# Altium project sig_gen_card.PrjPcb (part 2 of 4)

## Sheet Power.SchDoc
size B; Organization: Mechanart, LLC; Address1: 397 Laurie Meadows Drive; Address2: Apt. 437; Address3: San Mateo, CA 94403
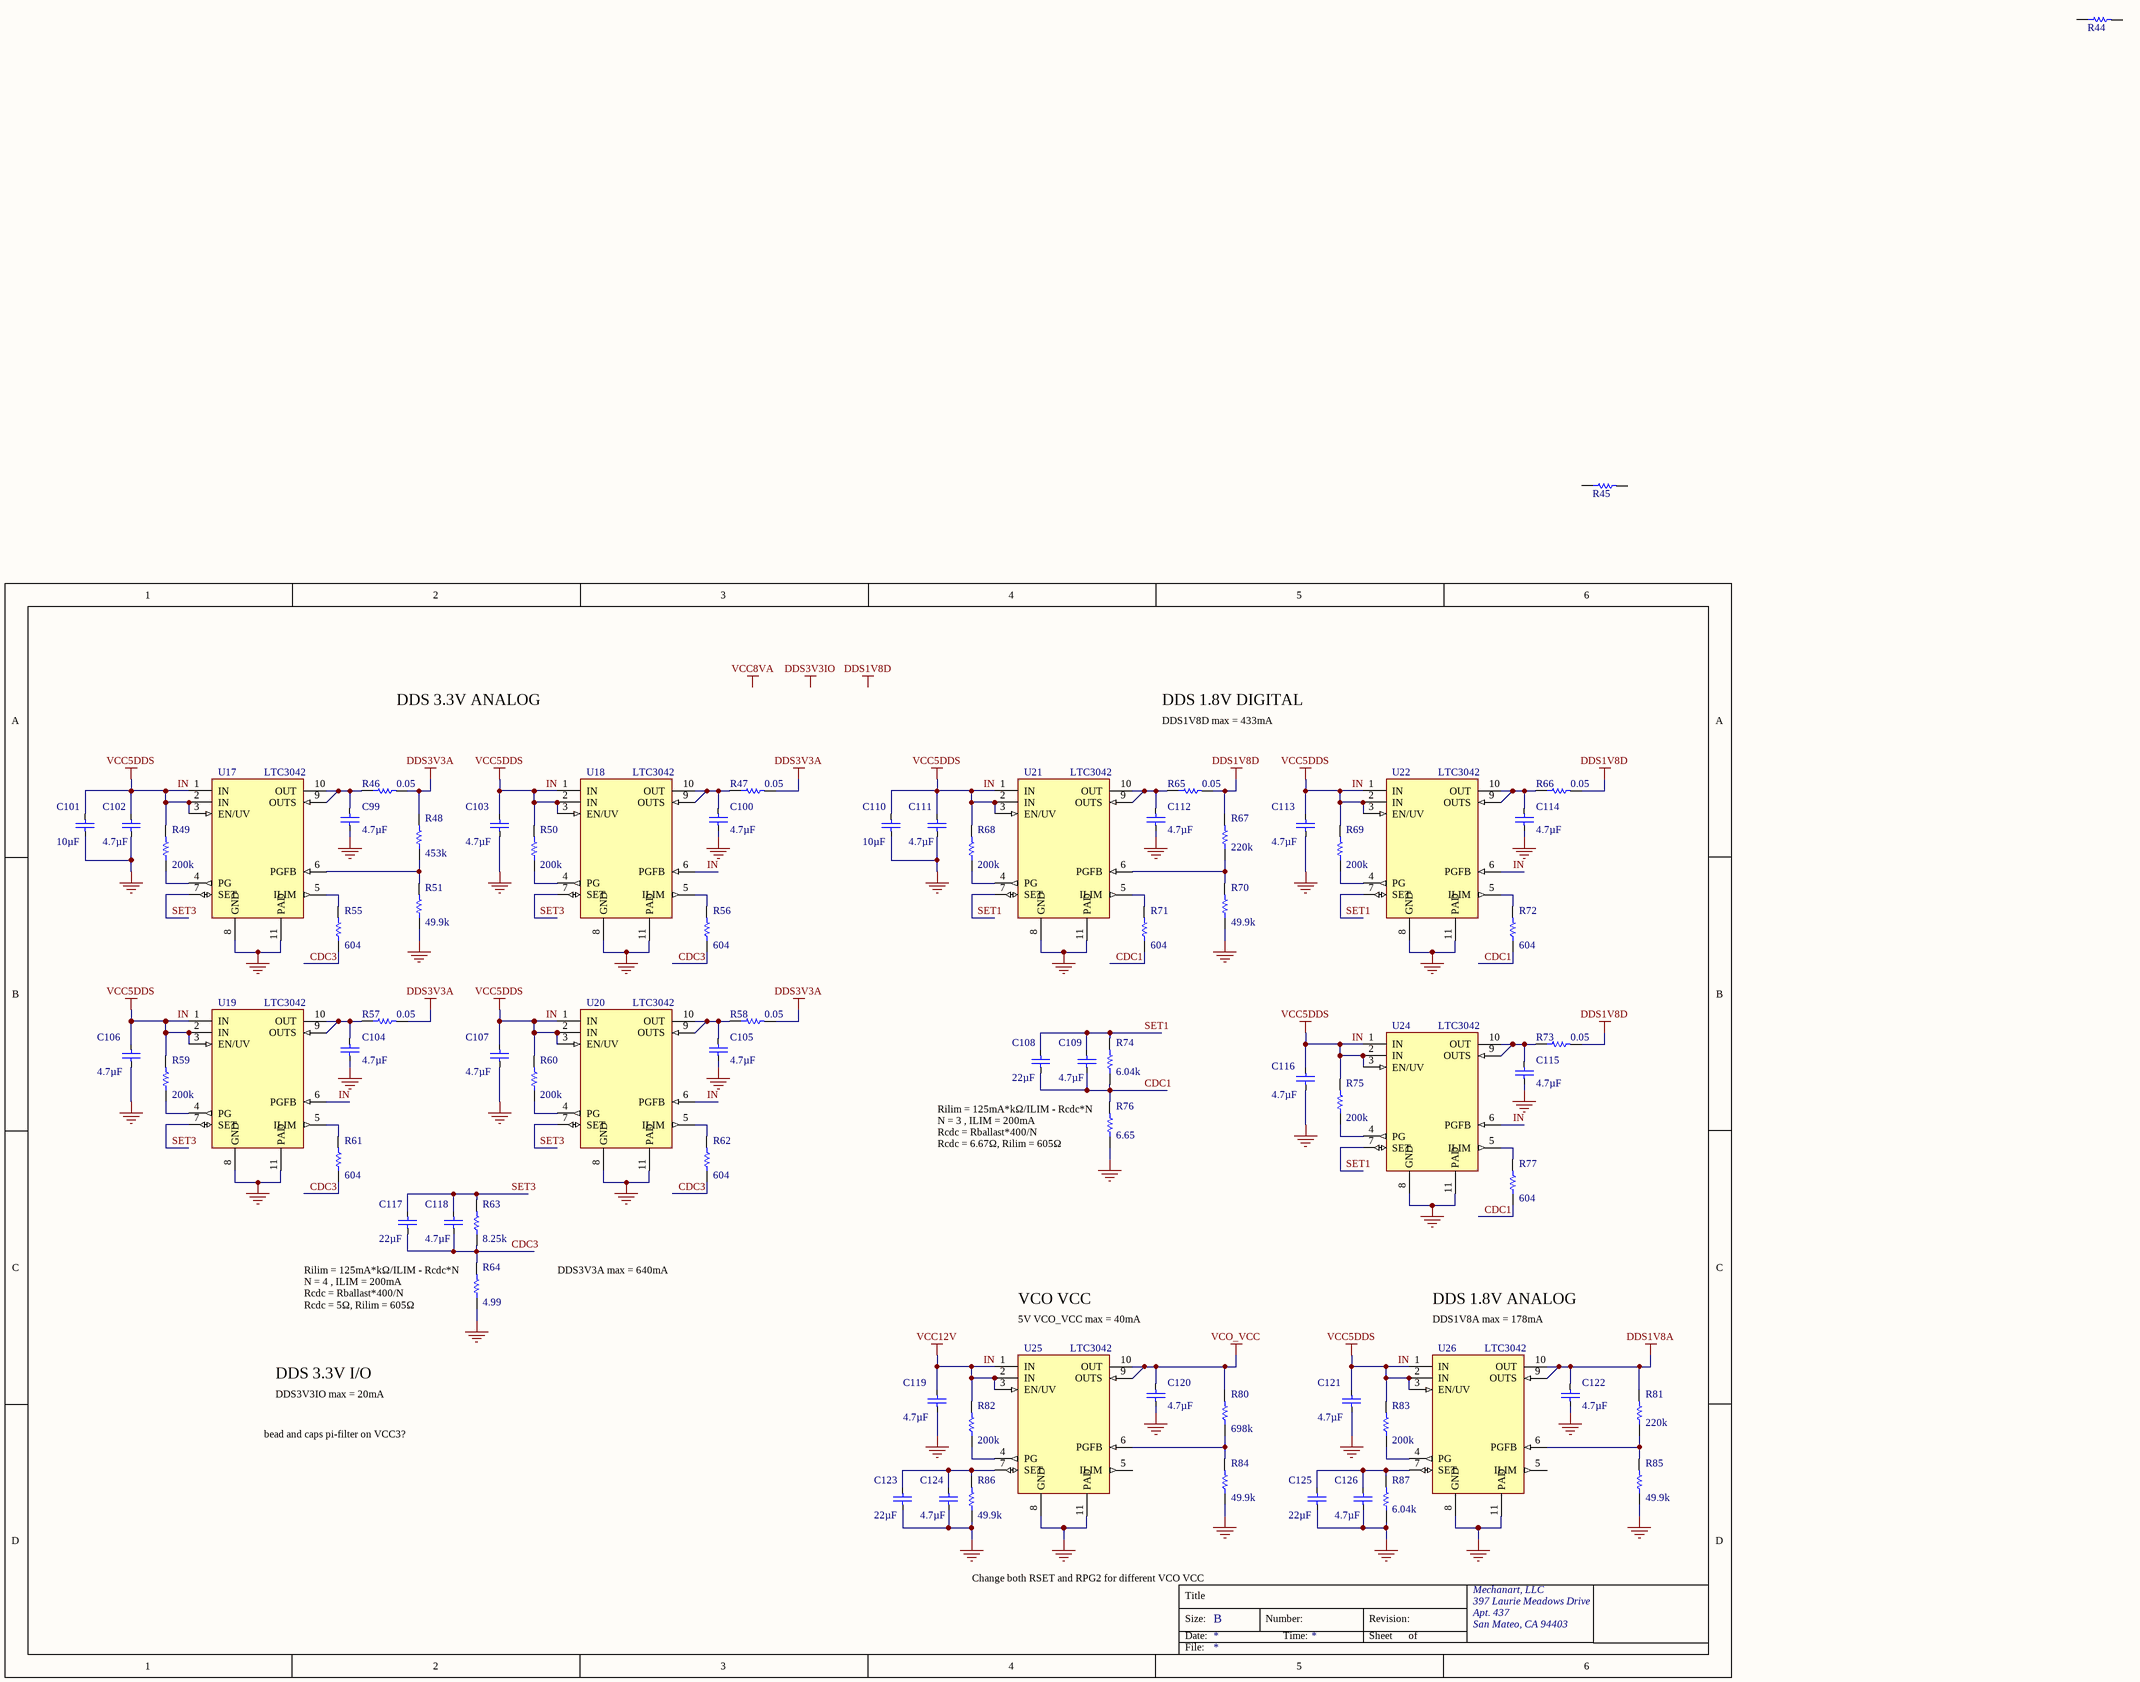
[diagram p3: Power.SchDoc]

### Parts
(Parts that share a designator on the sheet are numbered #1, #2 ... from top to bottom, then left to right.)
C99#1  4.7µF  [CAPC3216X160L55N]
C100#1  4.7µF  [CAPC3216X160L55N]
C101#1  10µF  [CAPC3216X160L55N]
C102#1  4.7µF  [CAPC3216X160L55N]
C103  4.7µF  [CAPC3216X160L55N]
C104  4.7µF  [CAPC3216X160L55N]
C105  4.7µF  [CAPC3216X160L55N]
C106  4.7µF  [CAPC3216X160L55N]
C107  4.7µF  [CAPC3216X160L55N]
C108  22µF  [CAPC2012X145L30N]
C109  4.7µF  [CAPC3216X160L55N]
C110  10µF  [CAPC3216X160L55N]
C111  4.7µF  [CAPC3216X160L55N]
C112  4.7µF  [CAPC3216X160L55N]
C113  4.7µF  [CAPC3216X160L55N]
C114  4.7µF  [CAPC3216X160L55N]
C115  4.7µF  [CAPC3216X160L55N]
C116  4.7µF  [CAPC3216X160L55N]
C117  22µF  [CAPC2012X145L30N]
C118  4.7µF  [CAPC3216X160L55N]
C119  4.7µF  [CAPC3216X160L55N]
C120  4.7µF  [CAPC3216X160L55N]
C121  4.7µF  [CAPC3216X160L55N]
C122  4.7µF  [CAPC3216X160L55N]
C123  22µF  [CAPC2012X145L30N]
C124  4.7µF  [CAPC3216X160L55N]
C125  22µF  [CAPC2012X145L30N]
C126  4.7µF  [CAPC3216X160L55N]
R44  0.05  [RESC_2012[0805]_N]  (value not drawn)
R45  8.25k  [RESC1608X45L30N]  (value not drawn)
R46  0.05  [RESC_2012[0805]_N]
R47  0.05  [RESC_2012[0805]_N]
R48  453k  [RESC1608X45L30N]
R49  200k  [RESC1608X45L30N]
R50  200k  [RESC1608X45L30N]
R51  49.9k  [RESC1608X45L30N]
R55  604  [RESC1608X45L30N]
R56  604  [RESC1608X45L30N]
R57  0.05  [RESC_2012[0805]_N]
R58  0.05  [RESC_2012[0805]_N]
R59  200k  [RESC1608X45L30N]
R60  200k  [RESC1608X45L30N]
R61  604  [RESC1608X45L30N]
R62  604  [RESC1608X45L30N]
R63  8.25k  [RESC1608X45L30N]
R64  4.99  [RESC1608X45L30N]
R65  0.05  [RESC_2012[0805]_N]
R66  0.05  [RESC_2012[0805]_N]
R67  220k  [RESC1608X45L30N]
R68  200k  [RESC1608X45L30N]
R69  200k  [RESC1608X45L30N]
R70  49.9k  [RESC1608X45L30N]
R71  604  [RESC1608X45L30N]
R72  604  [RESC1608X45L30N]
R73  0.05  [RESC_2012[0805]_N]
R74  6.04k  [RESC1608X45L30N]
R75  200k  [RESC1608X45L30N]
R76  6.65  [RESC1608X45L30N]
R77  604  [RESC1608X45L30N]
R80  698k  [RESC1608X45L30N]
R81  220k  [RESC1608X45L30N]
R82  200k  [RESC1608X45L30N]
R83  200k  [RESC1608X45L30N]
R84  49.9k  [RESC1608X45L30N]
R85  49.9k  [RESC1608X45L30N]
R86  49.9k  [RESC1608X45L30N]
R87  6.04k  [RESC1608X45L30N]
U17  LTC3042  [SON50P300X300X75-11T175X248L]
U18  LTC3042  [SON50P300X300X75-11T175X248L]
U19  LTC3042  [SON50P300X300X75-11T175X248L]
U20  LTC3042  [SON50P300X300X75-11T175X248L]
U21  LTC3042  [SON50P300X300X75-11T175X248L]
U22  LTC3042  [SON50P300X300X75-11T175X248L]
U24  LTC3042  [SON50P300X300X75-11T175X248L]
U25  LTC3042  [SON50P300X300X75-11T175X248L]
U26#1  LTC3042  [SON50P300X300X75-11T175X248L]

### Nets
DDS1V8A: C122.1 R81.2 U26#1.9(OUTS) U26#1.10(OUT)
DDS1V8D: R65.2 R66.2 R67.2 R73.2
DDS3V3A: R46.2 R47.2 R48.2 R57.2 R58.2
GND: C99#1.2 C100#1.2 C101#1.2 C102#1.2 C103.2 C104.2 C105.2 C106.2 C107.2 C110.2 C111.2 C112.2 C113.2 C114.2 C115.2 C116.2 C119.2 C120.2 C121.2 C122.2 C123.2 C124.2 C125.2 C126.2 R51.1 R64.1 R70.1 R76.1 R84.1 R85.1 R86.1 R87.1 U17.8(GND) U17.11(PAD) U18.8(GND) U18.11(PAD) U19.8(GND) U19.11(PAD) U20.8(GND) U20.11(PAD) U21.8(GND) U21.11(PAD) U22.8(GND) U22.11(PAD) U24.8(GND) U24.11(PAD) U25.8(GND) U25.11(PAD) U26#1.8(GND) U26#1.11(PAD)
IN: C101#1.1 C102#1.1 C103.1 C106.1 C107.1 C110.1 C111.1 C113.1 C116.1 C119.1 C121.1 R49.2 R50.2 R59.2 R60.2 R68.2 R69.2 R75.2 R82.2 R83.2 U17.1(IN) U17.2(IN) U17.3(EN/UV) U18.1(IN) U18.2(IN) U18.3(EN/UV) U18.6(PGFB) U19.1(IN) U19.2(IN) U19.3(EN/UV) U19.6(PGFB) U20.1(IN) U20.2(IN) U20.3(EN/UV) U20.6(PGFB) U21.1(IN) U21.2(IN) U21.3(EN/UV) U22.1(IN) U22.2(IN) U22.3(EN/UV) U22.6(PGFB) U24.1(IN) U24.2(IN) U24.3(EN/UV) U24.6(PGFB) U25.1(IN) U25.2(IN) U25.3(EN/UV) U26#1.1(IN) U26#1.2(IN) U26#1.3(EN/UV)  [also labelled VCC12V, VCC5DDS]
VCO_VCC: C120.1 R80.2 U25.9(OUTS) U25.10(OUT)
CDC1: C108.2 C109.2 R71.1 R72.1 R74.1 R76.2 R77.1
CDC3: C117.2 C118.2 R55.1 R56.1 R61.1 R62.1 R63.1 R64.2
SET1: C108.1 C109.1 R74.2 U21.7(SET) U22.7(SET) U24.7(SET)
SET3: C117.1 C118.1 R63.2 U17.7(SET) U18.7(SET) U19.7(SET) U20.7(SET)
NetC99#1_1: C99#1.1 R46.1 U17.9(OUTS) U17.10(OUT)
NetC100#1_1: C100#1.1 R47.1 U18.9(OUTS) U18.10(OUT)
NetC104_1: C104.1 R57.1 U19.9(OUTS) U19.10(OUT)
NetC105_1: C105.1 R58.1 U20.9(OUTS) U20.10(OUT)
NetC112_1: C112.1 R65.1 U21.9(OUTS) U21.10(OUT)
NetC114_1: C114.1 R66.1 U22.9(OUTS) U22.10(OUT)
NetC115_1: C115.1 R73.1 U24.9(OUTS) U24.10(OUT)
NetC123_1: C123.1 C124.1 R86.2 U25.7(SET)
NetC125_1: C125.1 C126.1 R87.2 U26#1.7(SET)
NetR48_1: R48.1 R51.2 U17.6(PGFB)
NetR49_1: R49.1 U17.4(PG)
NetR50_1: R50.1 U18.4(PG)
NetR55_2: R55.2 U17.5(ILIM)
NetR56_2: R56.2 U18.5(ILIM)
NetR59_1: R59.1 U19.4(PG)
NetR60_1: R60.1 U20.4(PG)
NetR61_2: R61.2 U19.5(ILIM)
NetR62_2: R62.2 U20.5(ILIM)
NetR67_1: R67.1 R70.2 U21.6(PGFB)
NetR68_1: R68.1 U21.4(PG)
NetR69_1: R69.1 U22.4(PG)
NetR71_2: R71.2 U21.5(ILIM)
NetR72_2: R72.2 U22.5(ILIM)
NetR75_1: R75.1 U24.4(PG)
NetR77_2: R77.2 U24.5(ILIM)
NetR80_1: R80.1 R84.2 U25.6(PGFB)
NetR81_1: R81.1 R85.2 U26#1.6(PGFB)
NetR82_1: R82.1 U25.4(PG)
NetR83_1: R83.1 U26#1.4(PG)

Not connected (* = marked no-connect by the designer): R44 1 2; R45 1 2; U25 5(ILIM); U26#1 5(ILIM)

### Notes on the sheet
- DDS 3.3V ANALOG
- DDS 1.8V DIGITAL
- DDS1V8D max = 433mA
- (near R76) Rilim = 125mA*kΩ/ILIM - Rcdc*N
  N = 3 , ILIM = 200mA
  Rcdc = Rballast*400/N
  Rcdc = 6.67Ω, Rilim = 605Ω
- (near R64) Rilim = 125mA*kΩ/ILIM - Rcdc*N
  N = 4 , ILIM = 200mA
  Rcdc = Rballast*400/N
  Rcdc = 5Ω, Rilim = 605Ω
- DDS3V3A max = 640mA
- VCO VCC
- (near U25) 5V VCO_VCC max = 40mA
- DDS 1.8V ANALOG
- (near U26#1) DDS1V8A max = 178mA
- DDS 3.3V I/O
- DDS3V3IO max = 20mA
- bead and caps pi-filter on VCC3?
- Change both RSET and RPG2 for different VCO VCC
- Labels drawn without touching a wire or pin: DDS1V8D, DDS3V3IO, VCC8VA
- Title
- Size:
- Date:
- B
- Number:
- Time:
- Revision:
- Sheet
- of
- File:

### Library data of the parts
C99#1 C100#1 C102#1 C103-C107 C109 C111-C116 C118-C122 C124 C126 = GCM31CR71E475KA55L: CAP CER 4.7UF 25V X7R 1206; Manufacturer: Murata Electronics North America; Tolerance: ±10%; Design Item Id: GCM31CR71E475KA55L; Supplier 1: Digi-Key; Supplier Part Number 1: 490-4794-1-ND; Manufacturer Part Number: GCM31CR71E475KA55L; RoHS: RoHS Compliant; Category: Capacitors; Stock 1: 40626; Pricing 1: 1=0.52, 10=0.494, 25=0.35, 50=0.2948, 100=0.2395, 250=0.199, 500=0.18056, 1000=0.16583 (USD); Packaging: Cut Tape (CT); Applications: Automotive; Operating Temperature: -55°C ~ 125°C; Mounting Type: Surface Mount, MLCC; Package / Case: 1206 (3216 Metric); ComponentLink1URL: http://www.murata.com/products/catalog/pdf/c03e.pdf; ComponentLink1Description: http://www.murata.com/products/catalog/pdf/c03e.pdf; Capacitance: 4.7µF; Voltage - Rated: 25V; Temperature Coefficient: X7R; Ratings: AEC-Q200; Size / Dimension: 0.126" L x 0.063" W (3.20mm x 1.60mm); Height - Seated (Max): -; Thickness (Max): 0.071" (1.80mm); Lead Spacing: -; Features: -; Lead Style: -
C101#1 C110 = GRM31CR71E106KA12L: CAP CER 10UF 25V X7R 1206; Manufacturer: Murata Electronics North America; Tolerance: ±10%; Design Item Id: GRM31CR71E106KA12L; Supplier 1: Digi-Key; Supplier Part Number 1: 490-6518-1-ND; Manufacturer Part Number: GRM31CR71E106KA12L; RoHS: RoHS Compliant; Category: Capacitors; Stock 1: 157542; Pricing 1: 1=0.83, 10=0.706, 50=0.5194, 100=0.4129, 250=0.34632, 500=0.31302, 1000=0.28638 (USD); Packaging: Cut Tape (CT); Applications: General Purpose; Operating Temperature: -55°C ~ 125°C; Mounting Type: Surface Mount, MLCC; Package / Case: 1206 (3216 Metric); ComponentLink1URL: http://www.murata.com/~/media/webrenewal/support/library/catalog/products/capacitor/mlcc/c02e.pdf; ComponentLink1Description: http://www.murata.com/~/media/webrenewal/support/library/catalog/products/capacitor/mlcc/c02e.pdf; Capacitance: 10µF; Voltage - Rated: 25V; Temperature Coefficient: X7R; Ratings: -; Size / Dimension: 0.126" L x 0.063" W (3.20mm x 1.60mm); Height - Seated (Max): -; Thickness (Max): 0.071" (1.80mm); Lead Spacing: -; Features: -; Lead Style: -
C108 C117 C123 C125 = C2012X5R1C226K125AC: CAP CER 22UF 16V X5R 0805; Manufacturer: TDK Corporation; Tolerance: ±10%; Design Item Id: C2012X5R1C226K125AC; Supplier 1: Digi-Key; Supplier Part Number 1: 445-6797-1-ND; Manufacturer Part Number: C2012X5R1C226K125AC; RoHS: RoHS Compliant; Category: Capacitors; Stock 1: 448776; Pricing 1: 1=0.77, 10=0.737, 100=0.3575, 250=0.297, 500=0.2695, 1000=0.2475 (USD); Packaging: Cut Tape (CT); Applications: General Purpose; Operating Temperature: -55°C ~ 85°C; Mounting Type: Surface Mount, MLCC; Package / Case: 0805 (2012 Metric); ComponentLink1URL: https://product.tdk.com/info/en/catalog/datasheets/mlcc_commercial_general_en.pdf; ComponentLink1Description: https://product.tdk.com/info/en/catalog/datasheets/mlcc_commercial_general_en.pdf; Capacitance: 22µF; Voltage - Rated: 16V; Temperature Coefficient: X5R; Ratings: -; Size / Dimension: 0.079" L x 0.049" W (2.00mm x 1.25mm); Height - Seated (Max): -; Thickness (Max): 0.057" (1.45mm); Lead Spacing: -; Features: -; Lead Style: -
R44 R46 R47 R57 R58 R65 R66 R73 = WSL0805R0500FEA18: RES SMD 0.05 OHM 1% 1/4W 0805; Manufacturer: Vishay Dale; Power (Watts): 0.25W, 1/4W; Temperature Coefficient: ±75ppm/°C; Resistance: 0.05; Design Item Id: WSL0805R0500FEA18; Supplier 1: Digi-Key; Supplier Part Number 1: WSLB-.05CT-ND; Manufacturer Part Number: WSL0805R0500FEA18; RoHS: RoHS Compliant; Category: Resistors; Stock 1: 6290; Pricing 1: 1=1, 10=0.887, 25=0.8152, 50=0.7436, 100=0.6435, 250=0.5434, 500=0.4576, 1000=0.38038, 2500=0.3718 (USD); Packaging: Cut Tape (CT); Operating Temperature: -65°C ~ 170°C; Package / Case: 0805 (2012 Metric); Supplier Device Package: 0805; ComponentLink1URL: http://www.vishay.com/docs/31057/wslhigh.pdf; ComponentLink1Description: http://www.vishay.com/docs/31057/wslhigh.pdf; Tolerance: ±1%; Composition: Metal Element; Features: Current Sense, Moisture Resistant, Pulse Withstanding; Size / Dimension: 0.080" L x 0.050" W (2.03mm x 1.27mm); Height: 0.018" (0.46mm); Number of Terminations: 2
R45 R63 = CRCW06038K25FKEA: RES SMD 8.25K OHM 1% 1/10W 0603; Manufacturer: Vishay Dale; Power (Watts): 0.1W, 1/10W; Temperature Coefficient: ±100ppm/°C; Resistance: 8.25k; Design Item Id: CRCW06038K25FKEA; Supplier 1: Digi-Key; Supplier Part Number 1: 541-8.25KHCT-ND; Manufacturer Part Number: CRCW06038K25FKEA; RoHS: RoHS Compliant; Category: Resistors; Stock 1: 15435; Pricing 1: 10=0.081, 50=0.0436, 200=0.0251, 1000=0.01711 (USD); Packaging: Cut Tape (CT); Operating Temperature: -55°C ~ 155°C; Package / Case: 0603 (1608 Metric); Supplier Device Package: 0603 (1608 Metric); ComponentLink1URL: http://www.vishay.com/docs/20035/dcrcwe3.pdf; ComponentLink1Description: http://www.vishay.com/docs/20035/dcrcwe3.pdf; Tolerance: ±1%; Composition: Thick Film; Features: Automotive AEC-Q200; Size / Dimension: 0.061" L x 0.033" W (1.55mm x 0.85mm); Height: 0.020" (0.50mm); Number of Terminations: 2
R48 = CRCW0603453KFKEA: RES SMD 453K OHM 1% 1/10W 0603; Manufacturer: Vishay Dale; Power (Watts): 0.1W, 1/10W; Temperature Coefficient: ±100ppm/°C; Resistance: 453k; Design Item Id: CRCW0603453KFKEA; Footprint: RESC_1608[0603]_N; Supplier 1: Digi-Key; Supplier Part Number 1: 541-453KHCT-ND; Manufacturer Part Number: CRCW0603453KFKEA; RoHS: RoHS Compliant; Category: Resistors; Stock 1: 26923; Pricing 1: 10=0.081, 50=0.0436, 200=0.0251, 1000=0.01711 (USD); Packaging: Cut Tape (CT); Operating Temperature: -55°C ~ 155°C; Package / Case: 0603 (1608 Metric); Supplier Device Package: 0603 (1608 Metric); ComponentLink1URL: http://www.vishay.com/docs/20035/dcrcwe3.pdf; ComponentLink1Description: http://www.vishay.com/docs/20035/dcrcwe3.pdf; Tolerance: ±1%; Composition: Thick Film; Features: Automotive AEC-Q200; Size / Dimension: 0.061" L x 0.033" W (1.55mm x 0.85mm); Height: 0.020" (0.50mm); Number of Terminations: 2
R49 R50 R59 R60 R68 R69 R75 R82 R83 = CRCW0603200KFKEA: RES SMD 200K OHM 1% 1/10W 0603; Manufacturer: Vishay Dale; Power (Watts): 0.1W, 1/10W; Temperature Coefficient: ±100ppm/°C; Resistance: 200k; Design Item Id: CRCW0603200KFKEA; Supplier 1: Digi-Key; Supplier Part Number 1: 541-200KHCT-ND; Manufacturer Part Number: CRCW0603200KFKEA; RoHS: RoHS Compliant; Category: Resistors; Stock 1: 228048; Pricing 1: 10=0.081, 50=0.0436, 200=0.0251, 1000=0.01711 (USD); Packaging: Cut Tape (CT); Operating Temperature: -55°C ~ 155°C; Package / Case: 0603 (1608 Metric); Supplier Device Package: 0603 (1608 Metric); ComponentLink1URL: http://www.vishay.com/docs/20035/dcrcwe3.pdf; ComponentLink1Description: http://www.vishay.com/docs/20035/dcrcwe3.pdf; Tolerance: ±1%; Composition: Thick Film; Features: Automotive AEC-Q200; Size / Dimension: 0.061" L x 0.033" W (1.55mm x 0.85mm); Height: 0.020" (0.50mm); Number of Terminations: 2
R51 R70 R84-R86 = CRCW060349K9FKEA: RES SMD 49.9K OHM 1% 1/10W 0603; Manufacturer: Vishay Dale; Power (Watts): 0.1W, 1/10W; Temperature Coefficient: ±100ppm/°C; Resistance: 49.9k; Design Item Id: CRCW060349K9FKEA; Supplier 1: Digi-Key; Supplier Part Number 1: 541-49.9KHCT-ND; Manufacturer Part Number: CRCW060349K9FKEA; RoHS: RoHS Compliant; Category: Resistors; Stock 1: 147485; Pricing 1: 10=0.081, 50=0.0436, 200=0.0251, 1000=0.01711 (USD); Packaging: Cut Tape (CT); Operating Temperature: -55°C ~ 155°C; Package / Case: 0603 (1608 Metric); Supplier Device Package: 0603 (1608 Metric); ComponentLink1URL: http://www.vishay.com/docs/20035/dcrcwe3.pdf; ComponentLink1Description: http://www.vishay.com/docs/20035/dcrcwe3.pdf; Tolerance: ±1%; Composition: Thick Film; Features: Automotive AEC-Q200; Size / Dimension: 0.061" L x 0.033" W (1.55mm x 0.85mm); Height: 0.020" (0.50mm); Number of Terminations: 2
R55 R56 R61 R62 R71 R72 R77 = CRCW0603604RFKEA: RES SMD 604 OHM 1% 1/10W 0603; Manufacturer: Vishay Dale; Power (Watts): 0.1W, 1/10W; Temperature Coefficient: ±100ppm/°C; Resistance: 604; Design Item Id: CRCW0603604RFKEA; Supplier 1: Digi-Key; Supplier Part Number 1: 541-604HCT-ND; Manufacturer Part Number: CRCW0603604RFKEA; RoHS: RoHS Compliant; Category: Resistors; Stock 1: 19900; Pricing 1: 10=0.081, 50=0.0436, 200=0.0251, 1000=0.01711 (USD); Packaging: Cut Tape (CT); Operating Temperature: -55°C ~ 155°C; Package / Case: 0603 (1608 Metric); Supplier Device Package: 0603 (1608 Metric); ComponentLink1URL: http://www.vishay.com/docs/20035/dcrcwe3.pdf; ComponentLink1Description: http://www.vishay.com/docs/20035/dcrcwe3.pdf; Tolerance: ±1%; Composition: Thick Film; Features: Automotive AEC-Q200; Size / Dimension: 0.061" L x 0.033" W (1.55mm x 0.85mm); Height: 0.020" (0.50mm); Number of Terminations: 2
R64 = CRCW06034R99FKEA: RES SMD 4.99 OHM 1% 1/10W 0603; Manufacturer: Vishay Dale; Power (Watts): 0.1W, 1/10W; Temperature Coefficient: ±100ppm/°C; Resistance: 4.99; Design Item Id: CRCW06034R99FKEA; Supplier 1: Digi-Key; Supplier Part Number 1: 541-4.99HHCT-ND; Manufacturer Part Number: CRCW06034R99FKEA; RoHS: RoHS Compliant; Category: Resistors; Stock 1: 17452; Pricing 1: 10=0.081, 50=0.0436, 200=0.0251, 1000=0.01711 (USD); Packaging: Cut Tape (CT); Operating Temperature: -55°C ~ 155°C; Package / Case: 0603 (1608 Metric); Supplier Device Package: 0603 (1608 Metric); ComponentLink1URL: http://www.vishay.com/docs/20035/dcrcwe3.pdf; ComponentLink1Description: http://www.vishay.com/docs/20035/dcrcwe3.pdf; Tolerance: ±1%; Composition: Thick Film; Features: Automotive AEC-Q200; Size / Dimension: 0.061" L x 0.033" W (1.55mm x 0.85mm); Height: 0.020" (0.50mm); Number of Terminations: 2
R67 R81 = CRCW0603220KFKEA: RES SMD 220K OHM 1% 1/10W 0603; Manufacturer: Vishay Dale; Power (Watts): 0.1W, 1/10W; Temperature Coefficient: ±100ppm/°C; Resistance: 220k; Design Item Id: CRCW0603220KFKEA; Supplier 1: Digi-Key; Supplier Part Number 1: 541-220KHCT-ND; Manufacturer Part Number: CRCW0603220KFKEA; RoHS: RoHS Compliant; Category: Resistors; Stock 1: 49454; Pricing 1: 10=0.081, 50=0.0436, 200=0.0251, 1000=0.01711 (USD); Packaging: Cut Tape (CT); Operating Temperature: -55°C ~ 155°C; Package / Case: 0603 (1608 Metric); Supplier Device Package: 0603 (1608 Metric); ComponentLink1URL: http://www.vishay.com/docs/20035/dcrcwe3.pdf; ComponentLink1Description: http://www.vishay.com/docs/20035/dcrcwe3.pdf; Tolerance: ±1%; Composition: Thick Film; Features: Automotive AEC-Q200; Size / Dimension: 0.061" L x 0.033" W (1.55mm x 0.85mm); Height: 0.020" (0.50mm); Number of Terminations: 2
R74 R87 = CRCW06036K04FKEA: RES SMD 6.04K OHM 1% 1/10W 0603; Manufacturer: Vishay Dale; Power (Watts): 0.1W, 1/10W; Temperature Coefficient: ±100ppm/°C; Resistance: 6.04k; Design Item Id: CRCW06036K04FKEA; Supplier 1: Digi-Key; Supplier Part Number 1: 541-6.04KHCT-ND; Manufacturer Part Number: CRCW06036K04FKEA; RoHS: RoHS Compliant; Category: Resistors; Stock 1: 50865; Pricing 1: 10=0.081, 50=0.0436, 200=0.0251, 1000=0.01711 (USD); Packaging: Cut Tape (CT); Operating Temperature: -55°C ~ 155°C; Package / Case: 0603 (1608 Metric); Supplier Device Package: 0603 (1608 Metric); ComponentLink1URL: http://www.vishay.com/docs/20035/dcrcwe3.pdf; ComponentLink1Description: http://www.vishay.com/docs/20035/dcrcwe3.pdf; Tolerance: ±1%; Composition: Thick Film; Features: Automotive AEC-Q200; Size / Dimension: 0.061" L x 0.033" W (1.55mm x 0.85mm); Height: 0.020" (0.50mm); Number of Terminations: 2
R76 = CRCW06036R65FKEA: RES SMD 6.65 OHM 1% 1/10W 0603; Manufacturer: Vishay Dale; Power (Watts): 0.1W, 1/10W; Temperature Coefficient: ±100ppm/°C; Resistance: 6.65; Design Item Id: CRCW06036R65FKEA; Supplier 1: Digi-Key; Supplier Part Number 1: 541-6.65HHCT-ND; Manufacturer Part Number: CRCW06036R65FKEA; RoHS: RoHS Compliant; Category: Resistors; Stock 1: 4954; Pricing 1: 10=0.081, 50=0.0436, 200=0.0251, 1000=0.01711 (USD); Packaging: Cut Tape (CT); Operating Temperature: -55°C ~ 155°C; Package / Case: 0603 (1608 Metric); Supplier Device Package: 0603 (1608 Metric); ComponentLink1URL: http://www.vishay.com/docs/20035/dcrcwe3.pdf; ComponentLink1Description: http://www.vishay.com/docs/20035/dcrcwe3.pdf; Tolerance: ±1%; Composition: Thick Film; Features: Automotive AEC-Q200; Size / Dimension: 0.061" L x 0.033" W (1.55mm x 0.85mm); Height: 0.020" (0.50mm); Number of Terminations: 2
R80 = CRCW0603698KFKEA: RES SMD 698K OHM 1% 1/10W 0603; Manufacturer: Vishay Dale; Power (Watts): 0.1W, 1/10W; Temperature Coefficient: ±100ppm/°C; Resistance: 698k; Design Item Id: CRCW0603698KFKEA; Supplier 1: Digi-Key; Supplier Part Number 1: 541-698KHCT-ND; Manufacturer Part Number: CRCW0603698KFKEA; RoHS: RoHS Compliant; Category: Resistors; Stock 1: 13875; Pricing 1: 10=0.081, 50=0.0436, 200=0.0251, 1000=0.01711 (USD); Packaging: Cut Tape (CT); Operating Temperature: -55°C ~ 155°C; Package / Case: 0603 (1608 Metric); Supplier Device Package: 0603 (1608 Metric); ComponentLink1URL: http://www.vishay.com/docs/20035/dcrcwe3.pdf; ComponentLink1Description: http://www.vishay.com/docs/20035/dcrcwe3.pdf; Tolerance: ±1%; Composition: Thick Film; Features: Automotive AEC-Q200; Size / Dimension: 0.061" L x 0.033" W (1.55mm x 0.85mm); Height: 0.020" (0.50mm); Number of Terminations: 2
U17-U22 U24 U25 U26#1 = LT3042EDD#PBF: IC REG LDO ADJ 0.2A 10DFN; Manufacturer: Linear Technology; Voltage - Output: 0 V ~ 15 V; Voltage - Input: 1.8 V ~ 20 V; Current - Output: 200mA; Regulator Topology: Positive Adjustable; Voltage - Dropout (Typical): 0.35V @ 200mA; Number of Regulators: 1; Current - Limit (Min): 220mA; Design Item Id: LT3042EDD#PBF; Supplier 1: Digi-Key; Supplier Part Number 1: LT3042EDD#PBF-ND; Manufacturer Part Number: LT3042EDD#PBF; RoHS: RoHS Compliant; Category: Integrated Circuits (ICs); Stock 1: 2998; Pricing 1: 1=4.9, 25=3.2532, 100=2.73 (USD); Packaging: Tube; Operating Temperature: -40°C ~ 125°C; Mounting Type: Surface Mount; Package / Case: 10-WFDFN Exposed Pad; Supplier Device Package: 10-DFN (3x3); ComponentLink1URL: http://www.linear.com/docs/46159; ComponentLink1Description: http://www.linear.com/docs/46159

## Sheet EasyPHI_Core.SchDoc
size C; Organization: Mechanart, LLC; Address1: 397 Laurie Meadows Drive; Address2: Apt. 437; Address3: San Mateo, CA 94403
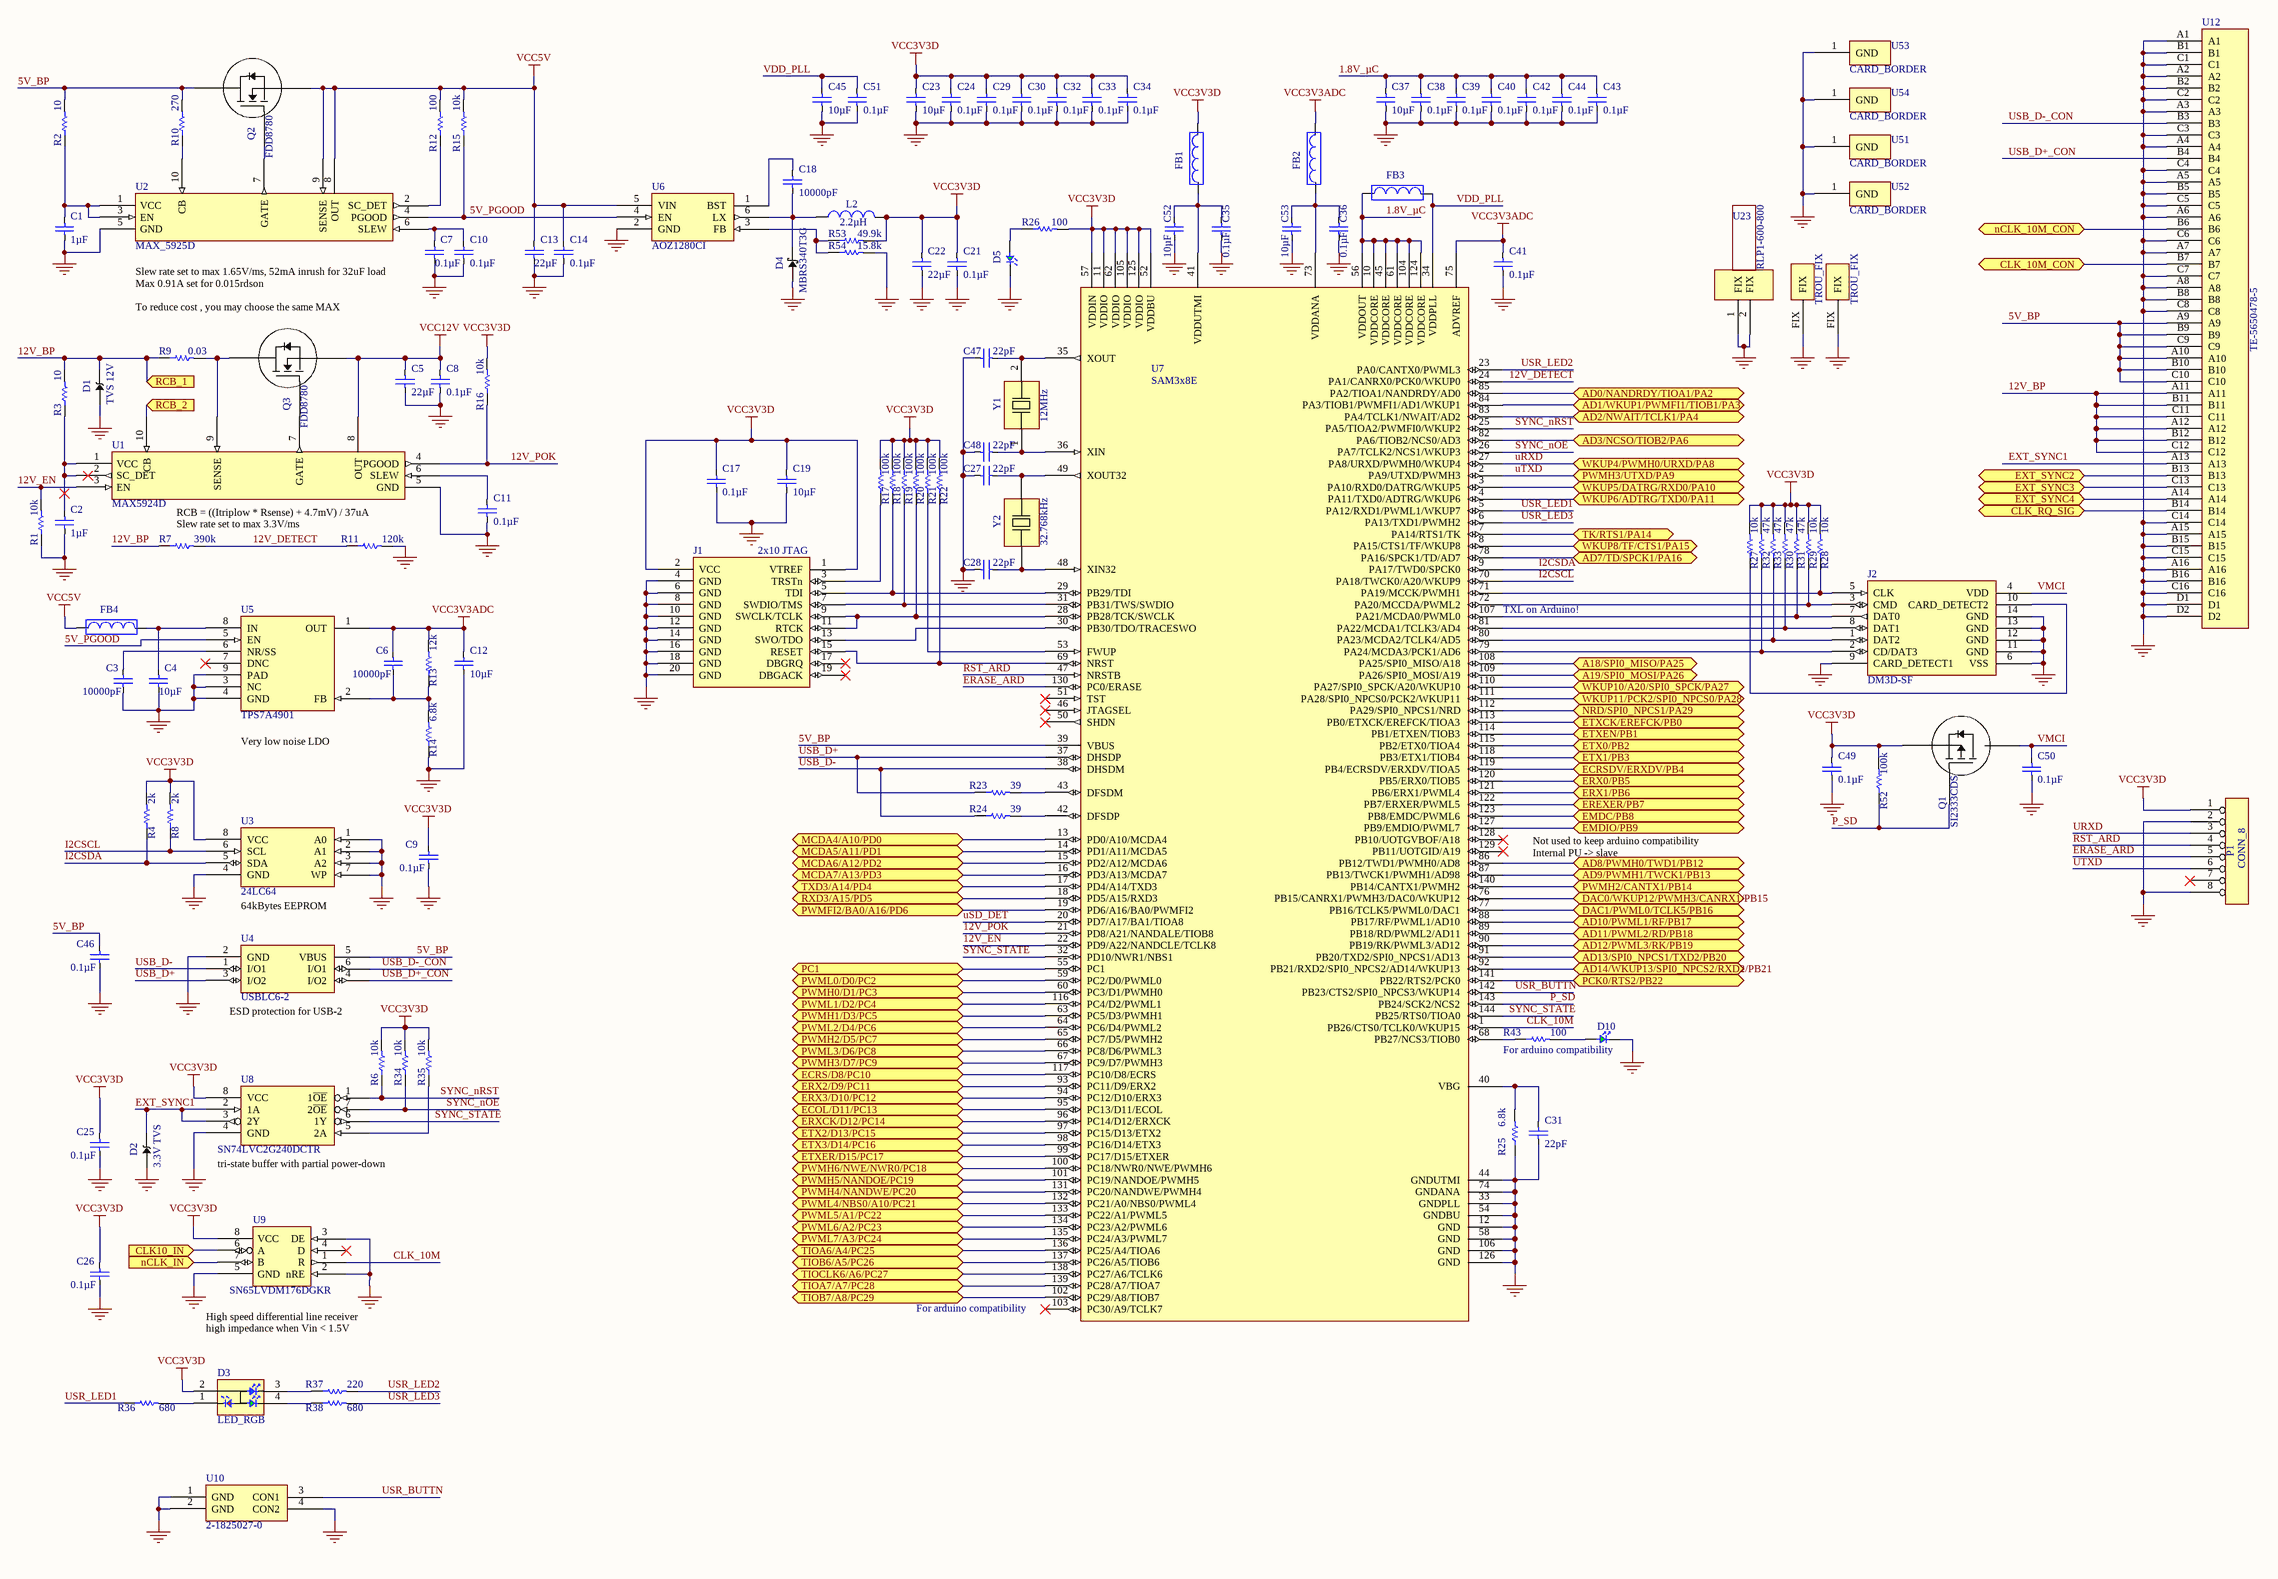
[diagram p4: EasyPHI_Core.SchDoc]

### Parts
C1  1µF  [CAPC1608X85L22N]
C2  1µF  [CAPC1608X85L22N]
C3  10000pF  [CAPC1608X85L22N]
C4  10µF  [CAPC1608X85L22N]
C5  22µF  [CAPC2012X145L30N]
C6  10000pF  [CAPC1608X85L22N]
C7  0.1µF  [CAPC1608X85L22N]
C8  0.1µF  [CAPC1608X85L22N]
C9  0.1µF  [CAPC1608X85L22N]
C10  0.1µF  [CAPC1608X85L22N]
C11  0.1µF  [CAPC1608X85L22N]
C12  10µF  [CAPC1608X85L22N]
C13  22µF  [CAPC2012X145L30N]
C14  0.1µF  [CAPC1608X85L22N]
C17  0.1µF  [CAPC1608X85L22N]
C18  10000pF  [CAPC1608X85L22N]
C19  10µF  [CAPC1608X85L22N]
C21  0.1µF  [CAPC1608X85L22N]
C22  22µF  [CAPC2012X145L30N]
C23  10µF  [CAPC1608X85L22N]
C24  0.1µF  [CAPC1608X85L22N]
C25  0.1µF  [CAPC1608X85L22N]
C26  0.1µF  [CAPC1608X85L22N]
C27  22pF  [CAPC1608X85L22N]
C28  22pF  [CAPC1608X85L22N]
C29  0.1µF  [CAPC1608X85L22N]
C30  0.1µF  [CAPC1608X85L22N]
C31  22pF  [CAPC1608X85L22N]
C32  0.1µF  [CAPC1608X85L22N]
C33  0.1µF  [CAPC1608X85L22N]
C34  0.1µF  [CAPC1608X85L22N]
C35  0.1µF  [CAPC1608X85L22N]
C36  0.1µF  [CAPC1608X85L22N]
C37  10µF  [CAPC1608X85L22N]
C38  0.1µF  [CAPC1608X85L22N]
C39  0.1µF  [CAPC1608X85L22N]
C40  0.1µF  [CAPC1608X85L22N]
C41  0.1µF  [CAPC1608X85L22N]
C42  0.1µF  [CAPC1608X85L22N]
C43  0.1µF  [CAPC1608X85L22N]
C44  0.1µF  [CAPC1608X85L22N]
C45  10µF  [CAPC1608X85L22N]
C46  0.1µF  [CAPC1608X85L22N]
C47  22pF  [CAPC1608X85L22N]
C48  22pF  [CAPC1608X85L22N]
C49  0.1µF  [CAPC1608X85L22N]
C50  0.1µF  [CAPC1608X85L22N]
C51  0.1µF  [CAPC1608X85L22N]
C52  10µF  [CAPC1608X85L22N]
C53  10µF  [CAPC1608X85L22N]
D1  TVS 12V  [DIOM5026X229N]
D2  3.3V TVS  [DIOM5336X265N]
D3  LED_RGB  [SOL150P350X210-4N]
D4  MBRS340T3G  [DIOM7958X241N]
D5  Green LED  [LEDC1608X75L40N]  (value not drawn)
D10  Green LED  [LEDC1608X75L40N]  (value not drawn)
FB1  Ferrite  [BEADC1608X75L40N]  (value not drawn)
FB2  Ferrite  [BEADC1608X75L40N]  (value not drawn)
FB3  Ferrite  [BEADC1608X75L40N]  (value not drawn)
FB4  Ferrite  [BEADC1608X75L40N]  (value not drawn)
J1  2x10 JTAG  [HDRVS20W25P100_10X2_1295X346H346]
J2  DM3D-SF  [DM3D-SF]
L2  2.2µH  [INDDFN600X600X280-2N]
P1  CONN_8  [HEADER_8_SMT_RA]
Q1  SI2333CDS  [SOT95P237X112-3L20N]
Q2  FDD8780  [TO229P990X239-3N]
Q3  FDD8780  [TO229P990X239-3N]
R1  10k  [RESC1608X45L30N]
R2  10  [RESC1608X45L30N]
R3  10  [RESC1608X45L30N]
R4  2k  [RESC1608X45L30N]
R6  10k  [RESC1608X45L30N]
R7  390k  [RESC1608X45L30N]
R8  2k  [RESC1608X45L30N]
R9  0.03  [RESC2012X75L55N]
R10  270  [RESC1608X45L30N]
R11  120k  [RESC1608X45L30N]
R12  100  [RESC1608X45L30N]
R13  12k  [RESC1608X45L30N]
R14  6.8k  [RESC1608X45L30N]
R15  10k  [RESC1608X45L30N]
R16  10k  [RESC1608X45L30N]
R17  100k  [RESC1608X45L30N]
R18  100k  [RESC1608X45L30N]
R19  100k  [RESC1608X45L30N]
R20  100k  [RESC1608X45L30N]
R21  100k  [RESC1608X45L30N]
R22  100k  [RESC1608X45L30N]
R23  39  [RESC1608X45L30N]
R24  39  [RESC1608X45L30N]
R25  6.8k  [RESC1608X45L30N]
R26  100  [RESC1608X45L30N]
R27  10k  [RESC1608X45L30N]
R28  10k  [RESC1608X45L30N]
R29  10k  [RESC1608X45L30N]
R30  47k  [RESC1608X45L30N]
R31  47k  [RESC1608X45L30N]
R32  47k  [RESC1608X45L30N]
R33  47k  [RESC1608X45L30N]
R34  10k  [RESC1608X45L30N]
R35  10k  [RESC1608X45L30N]
R36  680  [RESC1608X45L30N]
R37  220  [RESC1608X45L30N]
R38  680  [RESC1608X45L30N]
R43  100  [RESC1608X45L30N]
R52  100k  [RESC1608X45L30N]
R53  49.9k  [RESC1608X45L30N]
R54  15.8k  [RESC1608X45L30N]
U1  MAX5924D  [SOP50P490X110-10L30N]
U2  MAX_5925D  [SOP50P490X110-10L30N]
U3  24LC64  [SOIC127P599X175-8L28N]
U4  USBLC6-2  [SOT95P280X125-6L30N]
U5  TPS7A4901  [SOP65P490X110-9L30T157X189N]
U6  AOZ1280CI  [SOT95P280X125-6L30N]
U7  SAM3x8E  [QFP50P2200X2200X145-144L35N]
U8  SN74LVC2G240DCTR  [SOP65P400X130-8L40N]
U9  SN65LVDM176DGKR  [SOP65P490X110-8L30N]
U10  2-1825027-0  [TE_FSMRAXXX]
U12  TE-5650478-5  [TE-5650478-5]
U15  TROU_FIX  [TROU_FIX]
U16  TROU_FIX  [TROU_FIX]
U23  RLP1-600-800  [RLP1-600-800]
U51  CARD_BORDER  [CARD_BORDER]
U52  CARD_BORDER  [CARD_BORDER]
U53  CARD_BORDER  [CARD_BORDER]
U54  CARD_BORDER  [CARD_BORDER]
Y1  12MHz  [XTALSC320X500X120-2N]
Y2  Frequency: 32.768kHz  [OSCL550P795X375X250-4N]  (hidden comment: ABS25)

### Ports
A18/SPI0_MISO/PA25, A19/SPI0_MOSI/PA26, AD0/NANDRDY/TIOA1/PA2, AD1/WKUP1/PWMFI1/TIOB1/PA3, AD2/NWAIT/TCLK1/PA4, AD3/NCSO/TIOB2/PA6, AD7/TD/SPCK1/PA16, AD8/PWMH0/TWD1/PB12, AD9/PWMH1/TWCK1/PB13, AD10/PWML1/RF/PB17, AD11/PWML2/RD/PB18, AD12/PWML3/RK/PB19, AD13/SPI0_NPCS1/TXD2/PB20, AD14/WKUP13/SPI0_NPCS2/RXD2/PB21, CLK10_IN (in), CLK_10M_CON, CLK_RQ_SIG, DAC0/WKUP12/PWMH3/CANRX1/PB15, DAC1/PWML0/TCLK5/PB16, ECOL/D11/PC13, ECRS/D8/PC10, ECRSDV/ERXDV/PB4, EMDC/PB8, EMDIO/PB9, EREXER/PB7, ERX0/PB5, ERX1/PB6, ERX2/D9/PC11, ERX3/D10/PC12, ERXCK/D12/PC14, ETX0/PB2, ETX1/PB3, ETX2/D13/PC15, ETX3/D14/PC16, ETXCK/EREFCK/PB0, ETXEN/PB1, ETXER/D15/PC17, EXT_SYNC2, EXT_SYNC3, EXT_SYNC4, MCDA4/A10/PD0, MCDA5/A11/PD1, MCDA6/A12/PD2, MCDA7/A13/PD3, nCLK_10M_CON, nCLK_IN (in), NRD/SPI0_NPCS1/PA29, PC1, PCK0/RTS2/PB22, PWMFI2/BA0/A16/PD6, PWMH0/D1/PC3, PWMH1/D3/PC5, PWMH2/CANTX1/PB14, PWMH2/D5/PC7, PWMH3/D7/PC9, PWMH3/UTXD/PA9, PWMH4/NANDWE/PC20, PWMH5/NANDOE/PC19, PWMH6/NWE/NWR0/PC18, PWML0/D0/PC2, PWML1/D2/PC4, PWML2/D4/PC6, PWML3/D6/PC8, PWML4/NBS0/A10/PC21, PWML5/A1/PC22, PWML6/A2/PC23, PWML7/A3/PC24, RCB_1 (in), RCB_2 (in), RXD3/A15/PD5, TIOA6/A4/PC25, TIOA7/A7/PC28, TIOB6/A5/PC26, TIOB7/A8/PC29, TIOCLK6/A6/PC27, TK/RTS1/PA14, TXD3/A14/PD4, WKUP4/PWMH0/URXD/PA8, WKUP5/DATRG/RXD0/PA10, WKUP6/ADTRG/TXD0/PA11, WKUP8/TF/CTS1/PA15, WKUP10/A20/SPI0_SPCK/PA27, WKUP11/PCK2/SPI0_NPCS0/PA28

### Nets
GND: C1.2 C2.2 C3.2 C4.2 C5.2 C7.2 C8.2 C9.2 C10.2 C11.2 C12.2 C13.2 C14.2 C17.2 C19.2 C21.2 C22.2 C23.2 C24.2 C25.2 C26.2 C27.1 C28.1 C29.2 C30.2 C31.1 C32.2 C33.2 C34.2 C35.2 C36.2 C37.2 C38.2 C39.2 C40.2 C41.2 C42.2 C43.2 C44.2 C45.2 C46.2 C47.1 C48.1 C49.2 C50.2 C51.2 C52.2 C53.2 D1.A D2.A D4.A D5.C D10.C J1.4(GND) J1.6(GND) J1.8(GND) J1.10(GND) J1.12(GND) J1.14(GND) J1.16(GND) J1.18(GND) J1.20(GND) J2.6(VSS) J2.9(CARD_DETECT1) J2.11(GND) J2.12(GND) J2.13(GND) J2.14(GND) P1.2 P1.8 R1.1 R11.2 R14.1 R25.1 R54.2 U1.5(GND) U2.5(GND) U3.1(A0) U3.2(A1) U3.3(A2) U3.4(GND) U3.7(WP) U4.2(GND) U5.3(NC) U5.4(GND) U5.9(PAD) U6.2(GND) U7.12(GND) U7.33(GNDPLL) U7.44(GNDUTMI) U7.54(GNDBU) U7.58(GND) U7.74(GNDANA) U7.106(GND) U7.126(GND) U8.4(GND) U9.2(nRE) U9.3(DE) U9.5(GND) U10.1(GND) U10.2(GND) U10.4(CON2) U12.A1 U12.A2 U12.A3 U12.A4 U12.A5 U12.A6 U12.A7 U12.A8 U12.A15 U12.A16 U12.B1 U12.B2 U12.B5 U12.B8 U12.B15 U12.B16 U12.C1 U12.C2 U12.C3 U12.C4 U12.C5 U12.C6 U12.C7 U12.C8 U12.C14 U12.C15 U12.C16 U12.D1 U12.D2 U15.FIX U16.FIX U23.1(FIX) U23.2(FIX) U51.1(GND) U52.1(GND) U53.1(GND) U54.1(GND)
VCC3V3ADC: C6.1 C12.1 C41.1 FB2.2 R13.2 U5.1(OUT) U7.75(ADVREF)
VCC3V3D: C9.1 C17.1 C19.1 C21.1 C22.1 C23.1 C24.1 C25.1 C26.1 C29.1 C30.1 C32.1 C33.1 C34.1 C49.1 D3.2(A) FB1.2 J1.1(VTREF) J1.2(VCC) L2.2 P1.1 Q1.2(S) R4.2 R6.2 R8.2 R16.2 R17.2 R18.2 R19.2 R20.2 R21.2 R22.2 R26.2 R27.2 R28.2 R29.2 R30.2 R31.2 R32.2 R33.2 R34.2 R35.2 R52.2 R53.2 U3.8(VCC) U7.11(VDDIO) U7.52(VDDBU) U7.57(VDDIN) U7.62(VDDIO) U7.105(VDDIO) U7.125(VDDIO) U8.8(VCC) U9.8(VCC)
VCC5V: C13.1 C14.1 FB4.1 Q2.3(S) R12.2 R15.2 U2.8(OUT) U2.9(SENSE) U6.5(VIN)
VCC12V: C5.1 C8.1 Q3.3(S) U1.8(OUT)  [project net IN]
1.8V_µC: C37.1 C38.1 C39.1 C40.1 C42.1 C43.1 C44.1 FB3.1 U7.10(VDDCORE) U7.45(VDDCORE) U7.56(VDDOUT) U7.61(VDDCORE) U7.104(VDDCORE) U7.124(VDDCORE)
5V_BP: C46.1 Q2.2(D) R2.2 R10.2 U4.5(VBUS) U7.39(VBUS) U12.A9 U12.A10 U12.B9 U12.B10 U12.C9 U12.C10
5V_PGOOD: R15.1 U2.4(PGOOD) U5.5(EN) U6.4(EN)
12V_BP: D1.C R3.2 R7.1 R9.1 U12.A11 U12.A12 U12.B11 U12.B12 U12.C11 U12.C12 ; port RCB_1
12V_DETECT: R7.2 R11.1 U7.24(PA1/CANRX0/PCK0/WKUP0)
12V_EN: R1.2 U1.3(EN) U7.22(PD9/A22/NANDCLE/TCLK8)
12V_POK: R16.1 U1.4(PGOOD) U7.21(PD8/A21/NANDALE/TIOB8)
CLK_10M: U7.1(PB26/CTS0/TCLK0/WKUP15) U9.1(R)
DDS_D0: U7.111(PA28/SPI0_NPCS0/PCK2/WKUP11) ; port WKUP11/PCK2/SPI0_NPCS0/PA28
DDS_D1: U7.110(PA27/SPI0_SPCK/A20/WKUP10) ; port WKUP10/A20/SPI0_SPCK/PA27
DDS_D2: U7.109(PA26/SPI0_MOSI/A19) ; port A19/SPI0_MOSI/PA26
DDS_D3: U7.108(PA25/SPI0_MISO/A18) ; port A18/SPI0_MISO/PA25
ERASE_ARD: P1.5 U7.130(PC0/ERASE)
EXT_SYNC1: D2.C U8.2(1A) U8.3(2Y) U12.A13
I2CSCL: R8.1 U3.6(SCL) U7.70(PA18/TWCK0/A20/WKUP9)
I2CSDA: R4.1 U3.5(SDA) U7.9(PA17/TWD0/SPCK0)
P_SD: Q1.1(G) R52.1 U7.143(PB24/SCK2/NCS2)
RST_ARD: P1.4 U7.47(NRSTB)
SYNC_nOE: R34.1 U7.26(PA7/TCLK2/NCS1/WKUP3) U8.7(2~{OE})
SYNC_nRST: R6.1 U7.25(PA5/TIOA2/PWMFI0/WKUP2) U8.1(1~{OE})
SYNC_STATE: U7.32(PD10/NWR1/NBS1) U7.144(PB25/RTS0/TIOA0) U8.6(1Y)
URXD: P1.3 U7.27(PA8/URXD/PWMH0/WKUP4) ; port WKUP4/PWMH0/URXD/PA8
USB_D+: R23.1 U4.3(I/O2) U7.37(DHSDP)
USB_D+_CON: U4.4(I/O2) U12.B4
USB_D-: R24.1 U4.1(I/O1) U7.38(DHSDM)
USB_D-_CON: U4.6(I/O1) U12.B3
uSD_DET: U7.20(PD7/A17/BA1/TIOA8)
USR_BUTTN: U7.142(PB23/CTS2/SPI0_NPCS3/WKUP14) U10.3(CON1)
USR_LED1: R36.1 U7.5(PA12/RXD1/PWML1/WKUP7)
USR_LED2: R37.2 U7.23(PA0/CANTX0/PWML3)
USR_LED3: R38.2 U7.6(PA13/TXD1/PWMH2)
UTXD: P1.6 U7.2(PA9/UTXD/PWMH3) ; port PWMH3/UTXD/PA9
VDD_PLL: C45.1 C51.1 FB3.2 U7.34(VDDPLL)
VMCI: C50.1 J2.4(VDD) Q1.3(D)
NetC1_1: C1.1 R2.1 U2.1(VCC) U2.3(EN)
NetC2_1: C2.1 R3.1 U1.1(VCC) U1.2(SC_DET)
NetC3_1: C3.1 U5.6(NR/SS)
NetC4_1: C4.1 FB4.2 U5.8(IN)
NetC6_2: C6.2 R13.1 R14.2 U5.2(FB)
NetC7_1: C7.1 C10.1 U2.6(SLEW)
NetC11_1: C11.1 U1.6(SLEW)
NetC18_1: C18.1 U6.1(BST)
NetC18_2: C18.2 D4.C L2.1 U6.6(LX)
NetC27_2: C27.2 U7.49(XOUT32) Y2.4(OSC2)
NetC28_2: C28.2 U7.48(XIN32) Y2.1(OSC1)
NetC31_2: C31.2 R25.2 U7.40(VBG)
NetC35_1: C35.1 C52.1 FB1.1 U7.41(VDDUTMI)
NetC36_1: C36.1 C53.1 FB2.1 U7.73(VDDANA)
NetC47_2: C47.2 U7.35(XOUT) Y1.2(OSC2)
NetC48_2: C48.2 U7.36(XIN) Y1.1(OSC1)
NetD3_1: D3.1(R_C) R36.2
NetD3_3: D3.3(B_C) R37.1
NetD3_4: D3.4(G_C) R38.1
NetD5_A: D5.A R26.1
NetD10_A: D10.A R43.2
NetJ1_3: J1.3(TRSTn) R17.1
NetJ1_5: J1.5(TDI) R18.1 U7.29(PB29/TDI)
NetJ1_7: J1.7(SWDIO/TMS) R19.1 U7.31(PB31/TWS/SWDIO)
NetJ1_9: J1.9(SWCLK/TCLK) J1.11(RTCK) R20.1 U7.28(PB28/TCK/SWCLK)
NetJ1_13: J1.13(SWO/TDO) U7.30(PB30/TDO/TRACESWO)
NetJ1_15: J1.15(RESET) R22.1 U7.69(NRST)
NetJ2_1: J2.1(DAT2) R33.1 U7.80(PA23/MCDA2/TCLK4/AD5)
NetJ2_2: J2.2(CD/DAT3) R32.1 U7.79(PA24/MCDA3/PCK1/AD6)
NetJ2_3: J2.3(CMD) R29.1 U7.72(PA20/MCCDA/PWML2)
NetJ2_5: J2.5(CLK) R28.1 U7.71(PA19/MCCK/PWMH1)
NetJ2_7: J2.7(DAT0) R31.1 U7.107(PA21/MCDA0/PWML0)
NetJ2_8: J2.8(DAT1) R30.1 U7.81(PA22/MCDA1/TCLK3/AD4)
NetJ2_10: J2.10(CARD_DETECT2) R27.1
NetQ2_1: Q2.1(G) U2.7(GATE)
NetQ3_1: Q3.1(G) U1.7(GATE)
NetQ3_2: Q3.2(D) R9.2 U1.9(SENSE)
NetR5_2: U1.10(CB) ; port RCB_2
NetR10_1: R10.1 U2.10(CB)
NetR12_1: R12.1 U2.2(SC_DET)
NetR21_1: R21.1 U7.53(FWUP)
NetR23_2: R23.2 U7.43(DFSDM)
NetR24_2: R24.2 U7.42(DFSDP)
NetR35_1: R35.1 U8.5(2A)
NetR43_1: R43.1 U7.68(PB27/NCS3/TIOB0)
NetR53_1: R53.1 R54.1 U6.3(FB)
NetU7_3: U7.3(PA10/RXD0/DATRG/WKUP5) ; port WKUP5/DATRG/RXD0/PA10
NetU7_4: U7.4(PA11/TXD0/ADTRG/WKUP6) ; port WKUP6/ADTRG/TXD0/PA11
NetU7_7: U7.7(PA14/RTS1/TK) ; port TK/RTS1/PA14
NetU7_8: U7.8(PA15/CTS1/TF/WKUP8) ; port WKUP8/TF/CTS1/PA15
NetU7_13: U7.13(PD0/A10/MCDA4) ; port MCDA4/A10/PD0
NetU7_14: U7.14(PD1/A11/MCDA5) ; port MCDA5/A11/PD1
NetU7_15: U7.15(PD2/A12/MCDA6) ; port MCDA6/A12/PD2
NetU7_16: U7.16(PD3/A13/MCDA7) ; port MCDA7/A13/PD3
NetU7_17: U7.17(PD4/A14/TXD3) ; port TXD3/A14/PD4
NetU7_18: U7.18(PD5/A15/RXD3) ; port RXD3/A15/PD5
NetU7_19: U7.19(PD6/A16/BA0/PWMFI2) ; port PWMFI2/BA0/A16/PD6
NetU7_55: U7.55(PC1) ; port PC1
NetU7_59: U7.59(PC2/D0/PWML0) ; port PWML0/D0/PC2
NetU7_60: U7.60(PC3/D1/PWMH0) ; port PWMH0/D1/PC3
NetU7_63: U7.63(PC5/D3/PWMH1) ; port PWMH1/D3/PC5
NetU7_64: U7.64(PC6/D4/PWML2) ; port PWML2/D4/PC6
NetU7_65: U7.65(PC7/D5/PWMH2) ; port PWMH2/D5/PC7
NetU7_66: U7.66(PC8/D6/PWML3) ; port PWML3/D6/PC8
NetU7_67: U7.67(PC9/D7/PWMH3) ; port PWMH3/D7/PC9
NetU7_76: U7.76(PB15/CANRX1/PWMH3/DAC0/WKUP12) ; port DAC0/WKUP12/PWMH3/CANRX1/PB15
NetU7_77: U7.77(PB16/TCLK5/PWML0/DAC1) ; port DAC1/PWML0/TCLK5/PB16
NetU7_78: U7.78(PA16/SPCK1/TD/AD7) ; port AD7/TD/SPCK1/PA16
NetU7_82: U7.82(PA6/TIOB2/NCS0/AD3) ; port AD3/NCSO/TIOB2/PA6
NetU7_83: U7.83(PA4/TCLK1/NWAIT/AD2) ; port AD2/NWAIT/TCLK1/PA4
NetU7_84: U7.84(PA3/TIOB1/PWMFI1/AD1/WKUP1) ; port AD1/WKUP1/PWMFI1/TIOB1/PA3
NetU7_85: U7.85(PA2/TIOA1/NANDRDY/AD0) ; port AD0/NANDRDY/TIOA1/PA2
NetU7_86: U7.86(PB12/TWD1/PWMH0/AD8) ; port AD8/PWMH0/TWD1/PB12
NetU7_87: U7.87(PB13/TWCK1/PWMH1/AD98) ; port AD9/PWMH1/TWCK1/PB13
NetU7_88: U7.88(PB17/RF/PWML1/AD10) ; port AD10/PWML1/RF/PB17
NetU7_89: U7.89(PB18/RD/PWML2/AD11) ; port AD11/PWML2/RD/PB18
NetU7_90: U7.90(PB19/RK/PWML3/AD12) ; port AD12/PWML3/RK/PB19
NetU7_91: U7.91(PB20/TXD2/SPI0_NPCS1/AD13) ; port AD13/SPI0_NPCS1/TXD2/PB20
NetU7_92: U7.92(PB21/RXD2/SPI0_NPCS2/AD14/WKUP13) ; port AD14/WKUP13/SPI0_NPCS2/RXD2/PB21
NetU7_93: U7.93(PC11/D9/ERX2) ; port ERX2/D9/PC11
NetU7_94: U7.94(PC12/D10/ERX3) ; port ERX3/D10/PC12
NetU7_95: U7.95(PC13/D11/ECOL) ; port ECOL/D11/PC13
NetU7_96: U7.96(PC14/D12/ERXCK) ; port ERXCK/D12/PC14
NetU7_97: U7.97(PC15/D13/ETX2) ; port ETX2/D13/PC15
NetU7_98: U7.98(PC16/D14/ETX3) ; port ETX3/D14/PC16
NetU7_99: U7.99(PC17/D15/ETXER) ; port ETXER/D15/PC17
NetU7_100: U7.100(PC18/NWR0/NWE/PWMH6) ; port PWMH6/NWE/NWR0/PC18
NetU7_101: U7.101(PC19/NANDOE/PWMH5) ; port PWMH5/NANDOE/PC19
NetU7_102: U7.102(PC29/A8/TIOB7) ; port TIOB7/A8/PC29
NetU7_112: U7.112(PA29/SPI0_NPCS1/NRD) ; port NRD/SPI0_NPCS1/PA29
NetU7_113: U7.113(PB0/ETXCK/EREFCK/TIOA3) ; port ETXCK/EREFCK/PB0
NetU7_114: U7.114(PB1/ETXEN/TIOB3) ; port ETXEN/PB1
NetU7_115: U7.115(PB2/ETX0/TIOA4) ; port ETX0/PB2
NetU7_116: U7.116(PC4/D2/PWML1) ; port PWML1/D2/PC4
NetU7_117: U7.117(PC10/D8/ECRS) ; port ECRS/D8/PC10
NetU7_118: U7.118(PB3/ETX1/TIOB4) ; port ETX1/PB3
NetU7_119: U7.119(PB4/ECRSDV/ERXDV/TIOA5) ; port ECRSDV/ERXDV/PB4
NetU7_120: U7.120(PB5/ERX0/TIOB5) ; port ERX0/PB5
NetU7_121: U7.121(PB6/ERX1/PWML4) ; port ERX1/PB6
NetU7_122: U7.122(PB7/ERXER/PWML5) ; port EREXER/PB7
NetU7_123: U7.123(PB8/EMDC/PWML6) ; port EMDC/PB8
NetU7_127: U7.127(PB9/EMDIO/PWML7) ; port EMDIO/PB9
NetU7_131: U7.131(PC20/NANDWE/PWMH4) ; port PWMH4/NANDWE/PC20
NetU7_132: U7.132(PC21/A0/NBS0/PWML4) ; port PWML4/NBS0/A10/PC21
NetU7_133: U7.133(PC22/A1/PWML5) ; port PWML5/A1/PC22
NetU7_134: U7.134(PC23/A2/PWML6) ; port PWML6/A2/PC23
NetU7_135: U7.135(PC24/A3/PWML7) ; port PWML7/A3/PC24
NetU7_136: U7.136(PC25/A4/TIOA6) ; port TIOA6/A4/PC25
NetU7_137: U7.137(PC26/A5/TIOB6) ; port TIOB6/A5/PC26
NetU7_138: U7.138(PC27/A6/TCLK6) ; port TIOCLK6/A6/PC27
NetU7_139: U7.139(PC28/A7/TIOA7) ; port TIOA7/A7/PC28
NetU7_140: U7.140(PB14/CANTX1/PWMH2) ; port PWMH2/CANTX1/PB14
NetU7_141: U7.141(PB22/RTS2/PCK0) ; port PCK0/RTS2/PB22
NetU9_6: U9.6(A) U12.B7 ; port CLK_10M_CON, port CLK10_IN
NetU9_7: U9.7(B) U12.B6 ; port nCLK_10M_CON, port nCLK_IN
NetU12_A14: U12.A14 ; port EXT_SYNC4
NetU12_B13: U12.B13 ; port EXT_SYNC2
NetU12_B14: U12.B14 ; port CLK_RQ_SIG
NetU12_C13: U12.C13 ; port EXT_SYNC3

Not connected (* = marked no-connect by the designer): J1 17(DBGRQ)* 19(DBGACK)*; P1 7*; U5 7(DNC)*; U7 46(JTAGSEL)* 50(SHDN)* 51(TST)* 103(PC30/A9/TCLK7)* 128(PB10/UOTGVBOF/A18)* 129(PB11/UOTGID/A19)*; U9 4(D)*; Y2 2(NC) 3(NC)

### Notes on the sheet
- Slew rate set to max 1.65V/ms, 52mA inrush for 32uF load
  Max 0.91A set for 0.015rdson
  To reduce cost , you may choose the same MAX
- RCB = ((Itriplow * Rsense) + 4.7mV) / 37uA
  Slew rate set to max 3.3V/ms
- (near U7) TXL on Arduino!
- (near U5) Very low noise LDO
- Not used to keep arduino compatibility
  Internal PU -> slave
- 64kBytes EEPROM
- (near U4) ESD protection for USB-2
- For arduino compatibility
- (near U8) tri-state buffer with partial power-down
- (near U9) High speed differential line receiver
  high impedance when Vin < 1.5V
- (near U7) For arduino compatibility
- Title
- Size:
- Date:
- File:
- C
- Number:
- Time:
- Revision:
- Sheet
- of